# EAGLE schematic heating-controller (EAGLE 6.4)
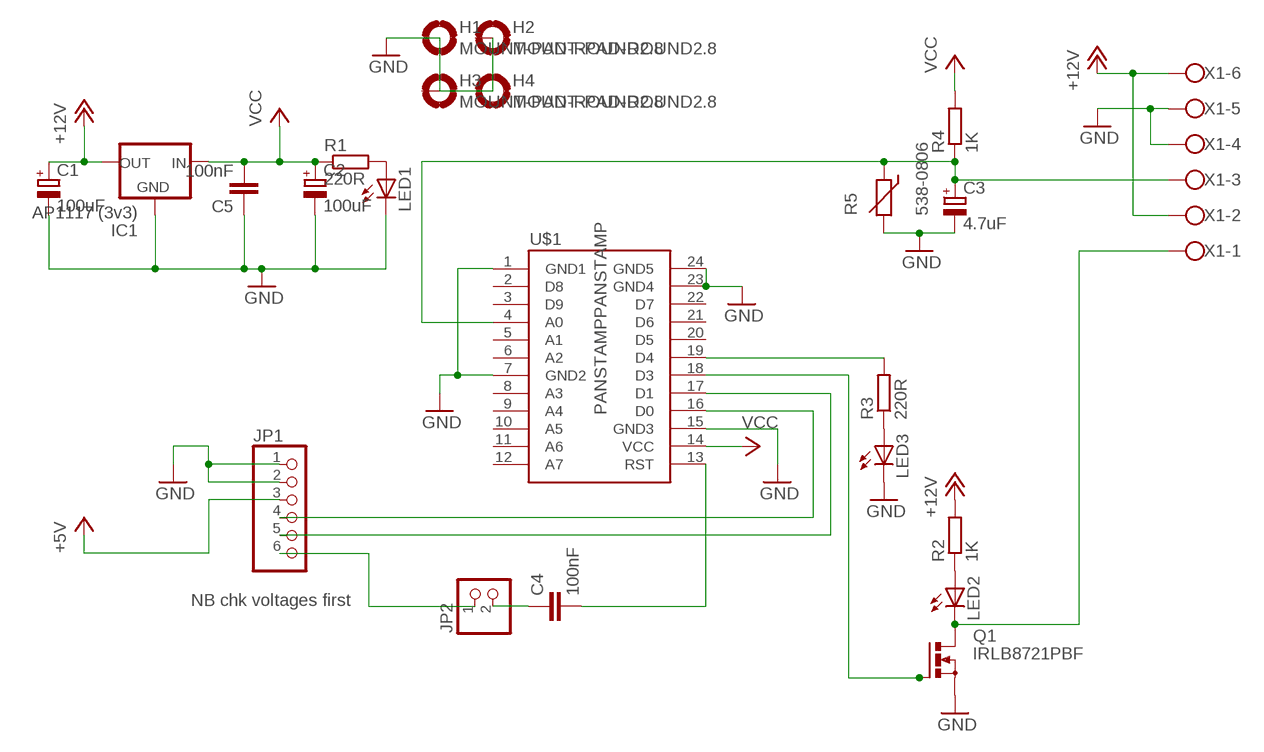
[diagram p0: schematic, sheet 1]

## Parts
C1  100uF  CPOL-EUE3.5-10  [E3,5-10]
C2  100uF  CPOL-EUE3.5-10  [E3,5-10]
C3  4.7uF  CPOL-EUE3.5-10  [E3,5-10]
C4  100nF  C-EU050-024X044  [C050-024X044]
C5  100nF  C-EU050-024X044  [C050-024X044]
H1  MOUNT-PAD-ROUND2.8  [2,8-PAD]
H2  MOUNT-PAD-ROUND2.8  [2,8-PAD]
H3  MOUNT-PAD-ROUND2.8  [2,8-PAD]
H4  MOUNT-PAD-ROUND2.8  [2,8-PAD]
IC1  AP1117 (3v3)  79XXS  [79XXS]
JP1  PINHD-1X6  [1X06]
JP2  PINHD-1X2  [1X02]
LED1  LED3MM  [LED3MM]
LED2  LED3MM  [LED3MM]
LED3  LED3MM  [LED3MM]
Q1  IRLB8721PBF  PMOSFET_NTO220BV  [TO220BV]
R1  220R  R-EU_0207/7  [0207/7]
R2  1K  R-EU_0207/7  [0207/7]
R3  220R  R-EU_0207/7  [0207/7]
R4  1K  R-EU_0207/7  [0207/7]
R5  538-0806  THERMISTOR-2,5  [RS-2,5]
U$1  PANSTAMPPANSTAMP  [DIL24-6]
X1  W237-6  [W237-6]

## Nets
+5V: JP1.3
+12V: C1.+ IC1.OUT R2.2 X1.2 X1.6
GND: C1.- C2.- C3.- C5.1 IC1.GND JP1.1 JP1.2 LED1.K(C) LED3.K(C) Q1.S R5.2 U$1.1(GND1) U$1.7(GND2) U$1.15(GND3) U$1.23(GND4) U$1.24(GND5) X1.4 X1.5
N$1: C3.+ R4.1 R5.1 U$1.4(A0) X1.3
N$2: R3.2 U$1.19(D4)
N$3: LED2.K(C) Q1.D X1.1
N$4: LED1.A R1.2
N$5: LED2.A R2.1
N$6: LED3.A R3.1
N$7: Q1.G U$1.18(D3)
N$8: C4.1 JP2.2
N$9: JP1.4 U$1.16(D0)
N$10: JP1.5 U$1.17(D1)
N$12: JP1.6 JP2.1
N$14: C4.2 U$1.13(RST)
VCC: C2.+ C5.2 IC1.IN R1.1 R4.2 U$1.14(VCC)
Unconnected: H1.B2,8(MOUNT) H2.B2,8(MOUNT) H3.B2,8(MOUNT) H4.B2,8(MOUNT) U$1.2(D8) U$1.3(D9) U$1.5(A1) U$1.6(A2) U$1.8(A3) U$1.9(A4) U$1.10(A5) U$1.11(A6) U$1.12(A7) U$1.20(D5) U$1.21(D6) U$1.22(D7)

## Notes on the sheet
- NB chk voltages first

## Library data of the parts
C1-C3 = rcl:CPOL-EU: POLARIZED CAPACITOR, European symbol
C4 C5 = rcl:C-EU: CAPACITOR, European symbol
H1-H4 = holes:MOUNT-PAD-ROUND: MOUNTING PAD, round
IC1 = v-reg:79XXS: VOLTAGE REGULATOR
JP1 = pinhead:PINHD-1X6: PIN HEADER
JP2 = pinhead:PINHD-1X2: PIN HEADER
LED1-LED3 = led:LED: LED OSRAM: - CHIPLED LG R971, LG N971, LY N971, LG Q971, LY Q971, LO R971, LY R971 LH N974, LH R974 LS Q976, LO Q976, LY Q976 LO Q996 - Hyper CHIPLED LW Q18S LB Q993, LB Q99A, LB R99A - SideLED LS A670, LO A670, LY A670, LG A670, LP A670 LB A673, LV A673, LT A673, LW A673 LH A674 LY A675 LS A676, LA A676, LO A676, LY A676, LW A676 LS A679, LY A679, LG A679 - Hyper Micro SIDELED® LS Y876, LA Y876, LO Y876, LY Y876 LT Y87S - SmartLED LW L88C, LW L88S LB L89C, LB L89S, LG L890 LS L89K, LO L89K, LY L89K LS L896, LA L896, LO L896, LY L896 - TOPLED LS T670, LO T670, LY T670, LG T670, LP T670 LSG T670, LSP T670, LSY T670, LOP T670, LYG T670 LG T671, LOG T671, LSG T671 LB T673, LV T673, LT T673, LW T673 LH T674 LS T676, LA T676, LO T676, LY T676, LB T676, LH T676, LSB T676, LW T676 LB T67C, LV T67C, LT T67C, LS T67K, LO T67K, LY T67K, LW E67C LS E67B, LA E67B, LO E67B, LY E67B, LB E67C, LV E67C, LT E67C LW T67C LS T679, LY T679, LG T679 LS T770, LO T770, LY T770, LG T770, LP T770 LB T773, LV T773, LT T773, LW T773 LH T774 LS E675, LA E675, LY E675, LS T675 LS T776, LA T776, LO T776, LY T776, LB T776 LHGB T686 LT T68C, LB T68C - Hyper Mini TOPLED® LB M676 - Mini TOPLED Santana® LG M470 LS M47K, LO M47K, LY M47K Source: http://www.osram.convergy.de LUXEON: - LUMILED® LXK2-PW12-R00, LXK2-PW12-S00, LXK2-PW14-U00, LXK2-PW14-V00 LXK2-PM12-R00, LXK2-PM12-S00, LXK2-PM14-U00 LXK2-PE12-Q00, LXK2-PE12-R00, LXK2-PE12-S00, LXK2-PE14-T00, LXK2-PE14-U00 LXK2-PB12-K00, LXK2-PB12-L00, LXK2-PB12-M00, LXK2-PB14-N00, LXK2-PB14-P00, LXK2-PB14-Q00 LXK2-PR12-L00, LXK2-PR12-M00, LXK2-PR14-Q00, LXK2-PR14-R00 LXK2-PD12-Q00, LXK2-PD12-R00, LXK2-PD12-S00 LXK2-PH12-R00, LXK2-PH12-S00 LXK2-PL12-P00, LXK2-PL12-Q00, LXK2-PL12-R00 Source: www.luxeon.com KINGBRIGHT: KA-3528ASYC Source: www.kingbright.com
Q1 = transistor-power:PMOSFET_N: Power MOSFET N-Channel
R1-R4 = rcl:R-EU_: RESISTOR, European symbol
R5 = varistor:THERMISTOR: THERMISTOR
U$1 = panstamp:PANSTAMP: Panstamp wireless module
X1 = con-wago-500:W237-6: WAGO SCREW CLAMP; OC_FARNELL: unknown; OC_NEWARK: unknown